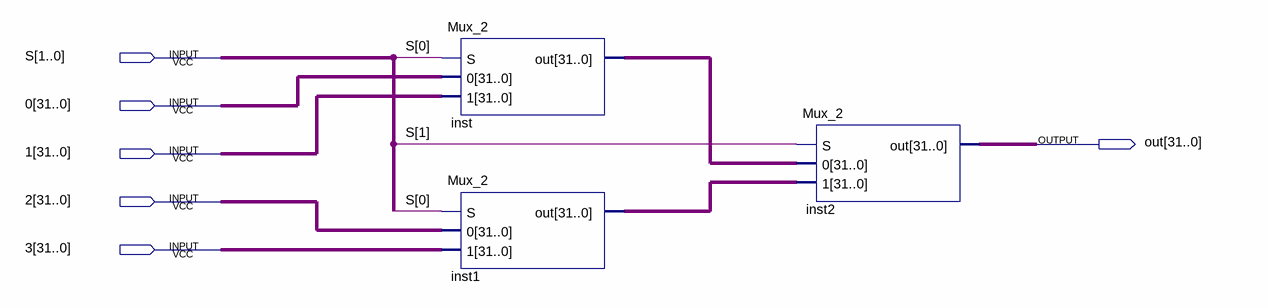
[diagram p0: schematic sheet]
// Quartus schematic Mux_4.bdf as structural Verilog: 3 symbols, 6 pins
module Mux_4 (
  input  [1:0] S,
  input  [31:0] \0 ,
  input  [31:0] \1 ,
  input  [31:0] \2 ,
  input  [31:0] \3 ,
  output [31:0] out
);

  wire [31:0] inst1_out, inst_out;

  Mux_2 inst (.S(S[0]), .\0 (\0 ), .\1 (\1 ), .out(inst_out));
  Mux_2 inst1 (.S(S[0]), .\0 (\2 ), .\1 (\3 ), .out(inst1_out));
  Mux_2 inst2 (.S(S[1]), .\0 (inst_out), .\1 (inst1_out), .out(out));
endmodule
